# EAGLE design dedo_rev_1_0 (EAGLE 9.2.2)
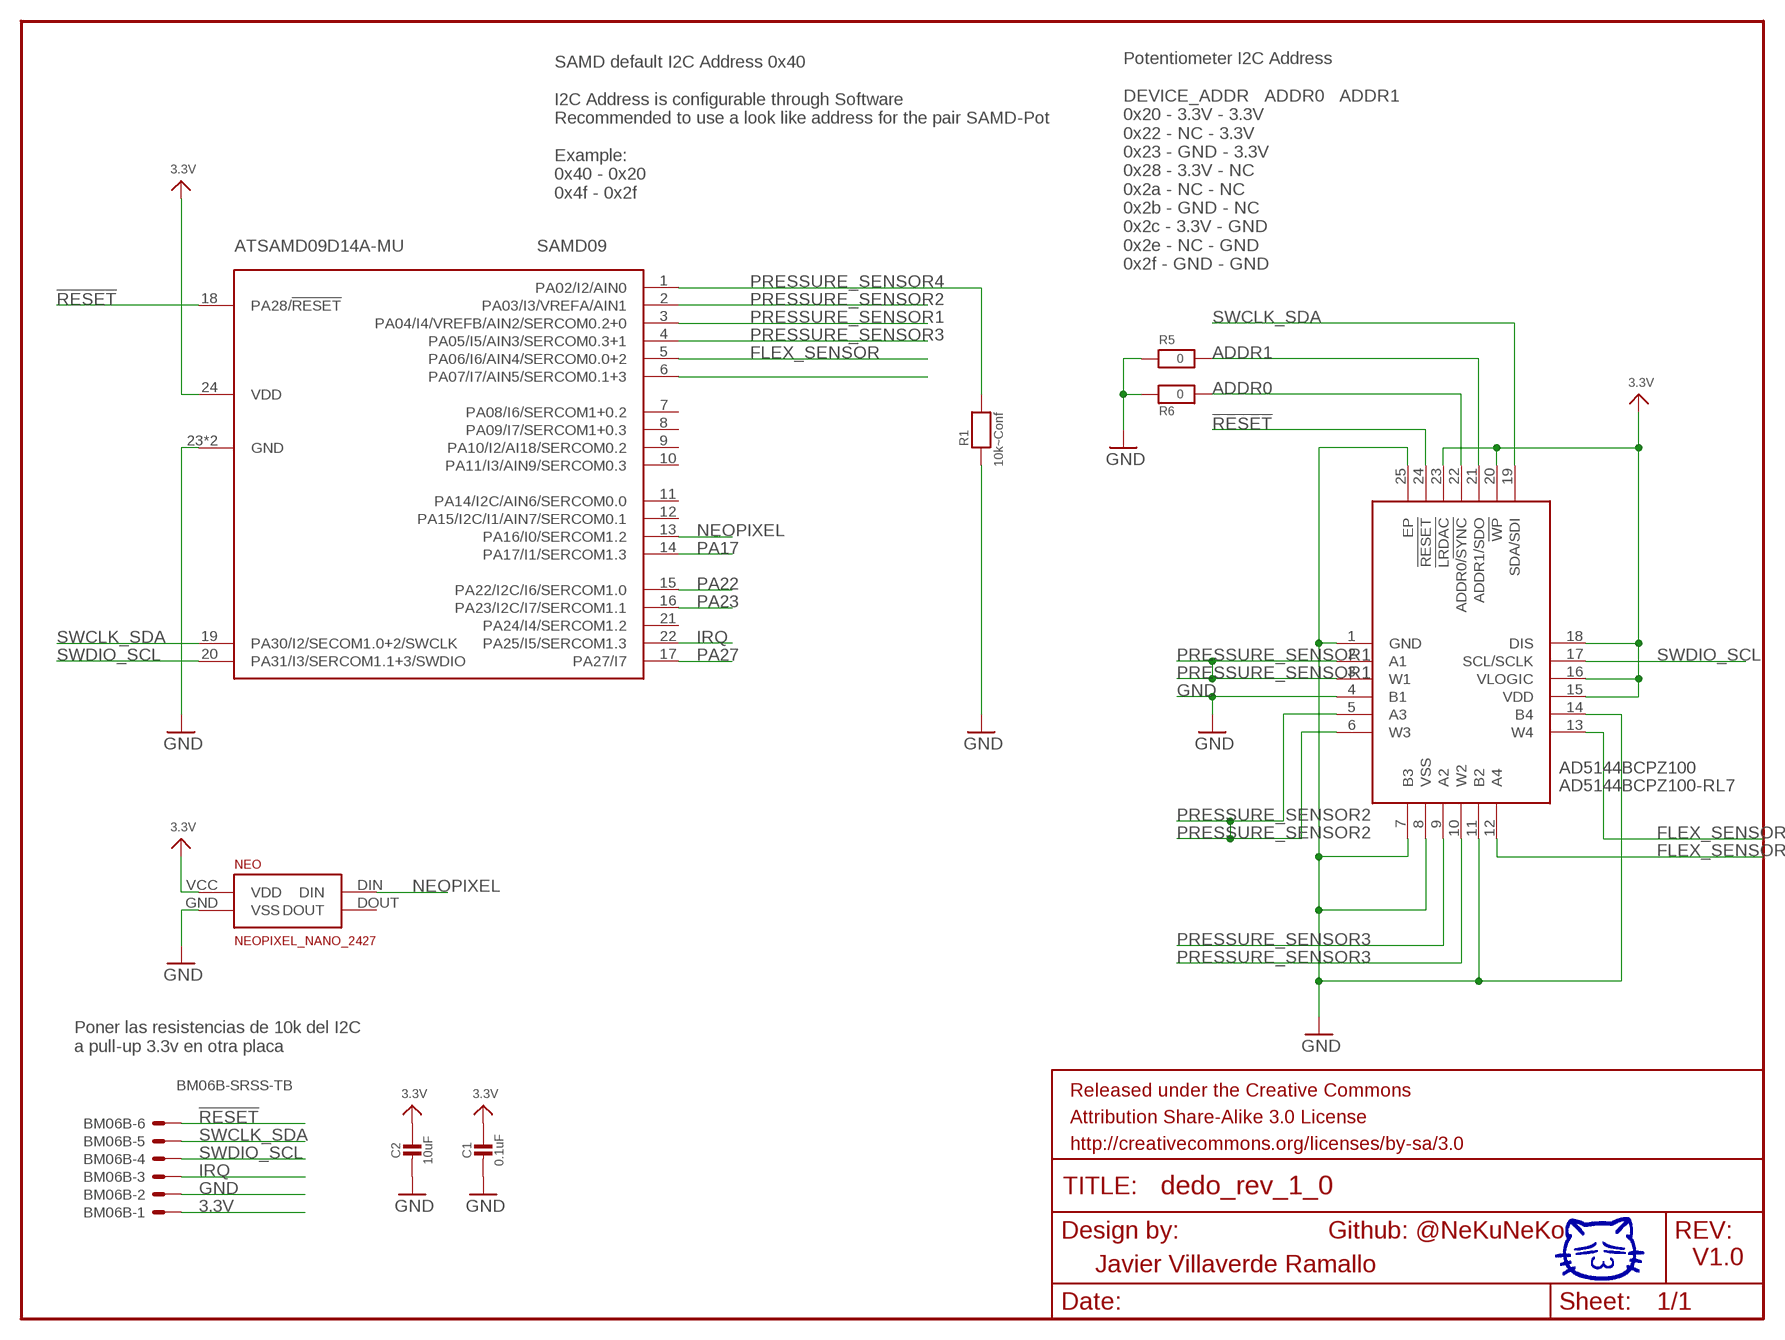
[diagram p0: schematic, sheet 1]

## Parts
AD5144BCPZ100  AD5144BCPZ100-RL7  [QFN50P400X400X80-25N]
BM06B  BM06B-SRSS-TB  [BM06B-SRSS-TB]
C1  0.1uF  CAP_CERAMIC0402  [0402]
C2  10uF  CAP_CERAMIC0402  [0402]
FRAME1  FRAME-LETTER  [CREATIVE_COMMONS]
FRAME2  FRAME-LETTER  [CREATIVE_COMMONS]
NEO  NEOPIXEL_NANO_2427  [SK6805-2427]
R1  10k~Conf  RESISTOR_0402  [_0402]
R5  0  RESISTOR_0402  [_0402]
R6  0  RESISTOR_0402  [_0402]
SAMD09  ATSAMD09D14A-MU  [QFN24_4MM]

## Nets
3.3V: AD5144BCPZ100.15(VDD) AD5144BCPZ100.16(VLOGIC) AD5144BCPZ100.18(DIS) AD5144BCPZ100.20(!WP) AD5144BCPZ100.23(!LRDAC) BM06B.1 C1.1 C2.1 NEO.VCC(VDD) SAMD09.24(VDD)
!RESET: AD5144BCPZ100.24(!RESET) BM06B.6 SAMD09.18(PA28/!RESET)
ADDR0: AD5144BCPZ100.22(ADDR0/!SYNC) R6.2
ADDR1: AD5144BCPZ100.21(ADDR1/SDO) R5.2
FLEX_SENSOR: AD5144BCPZ100.12(A4) AD5144BCPZ100.13(W4) SAMD09.5(PA06/I6/AIN4/SERCOM0.0+2)
GND: AD5144BCPZ100.1(GND) AD5144BCPZ100.4(B1) AD5144BCPZ100.7(B3) AD5144BCPZ100.8(VSS) AD5144BCPZ100.11(B2) AD5144BCPZ100.14(B4) AD5144BCPZ100.25(EP) BM06B.2 C1.2 C2.2 NEO.GND(VSS) R1.2 R5.1 R6.1 SAMD09.23(GND) SAMD09.THERM(GND)
IRQ: BM06B.3 SAMD09.22(PA25/I5/SERCOM1.3)
N$1: SAMD09.6(PA07/I7/AIN5/SERCOM0.1+3)
NEOPIXEL: NEO.DIN SAMD09.13(PA16/I0/SERCOM1.2)
PA17: SAMD09.14(PA17/I1/SERCOM1.3)
PA22: SAMD09.15(PA22/I2C/I6/SERCOM1.0)
PA23: SAMD09.16(PA23/I2C/I7/SERCOM1.1)
PA27: SAMD09.17(PA27/I7)
PRESSURE_SENSOR1: AD5144BCPZ100.2(A1) AD5144BCPZ100.3(W1) SAMD09.3(PA04/I4/VREFB/AIN2/SERCOM0.2+0)
PRESSURE_SENSOR2: AD5144BCPZ100.5(A3) AD5144BCPZ100.6(W3) SAMD09.2(PA03/I3/VREFA/AIN1)
PRESSURE_SENSOR3: AD5144BCPZ100.9(A2) AD5144BCPZ100.10(W2) SAMD09.4(PA05/I5/AIN3/SERCOM0.3+1)
PRESSURE_SENSOR4: R1.1 SAMD09.1(PA02/I2/AIN0)
SWCLK_SDA: AD5144BCPZ100.19(SDA/SDI) BM06B.5 SAMD09.19(PA30/I2/SECOM1.0+2/SWCLK)
SWDIO_SCL: AD5144BCPZ100.17(SCL/SCLK) BM06B.4 SAMD09.20(PA31/I3/SERCOM1.1+3/SWDIO)
Unconnected: NEO.DOUT SAMD09.7(PA08/I6/SERCOM1+0.2) SAMD09.8(PA09/I7/SERCOM1+0.3) SAMD09.9(PA10/I2/AI18/SERCOM0.2) SAMD09.10(PA11/I3/AIN9/SERCOM0.3) SAMD09.11(PA14/I2C/AIN6/SERCOM0.0) SAMD09.12(PA15/I2C/I1/AIN7/SERCOM0.1) SAMD09.21(PA24/I4/SERCOM1.2)

## Notes on the sheet
- SAMD default I2C Address 0x40
  
  I2C Address is configurable through Software
  Recommended to use a look like address for the pair SAMD-Pot
  
  Example: 
  0x40 - 0x20
  0x4f - 0x2f
- Potentiometer I2C Address
  
  DEVICE_ADDR   ADDR0   ADDR1   
  0x20 - 3.3V - 3.3V 
  0x22 - NC - 3.3V
  0x23 - GND - 3.3V
  0x28 - 3.3V - NC
  0x2a - NC - NC
  0x2b - GND - NC 
  0x2c - 3.3V - GND
  0x2e - NC - GND
  0x2f - GND - GND
- Poner las resistencias de 10k del I2C 
  a pull-up 3.3v en otra placa
- Github: @NeKuNeKo
- V1.0
- Javier Villaverde Ramallo

## Library data of the parts
AD5144BCPZ100 = SamacSys_Parts:AD5144BCPZ100-RL7: ANALOG DEVICES - AD5144BCPZ100-RL7 - DIGITAL POT, 100KOHM, QUAD, LFCSP-24 Source: Datasheet <http://www.analog.com/media/en/technical-documentation/data-sheets/AD5124_5144_5144A.pdf>; DESCRIPTION: ANALOG DEVICES - AD5144BCPZ100-RL7 - DIGITAL POT, 100KOHM, QUAD, LFCSP-24; HEIGHT: 0.8mm; MANUFACTURER_NAME: Analog Devices; MANUFACTURER_PART_NUMBER: AD5144BCPZ100-RL7; MOUSER_PART_NUMBER: 584-AD5144BCPZ100-R7; MOUSER_PRICE-STOCK: https://www.mouser.com/Search/Refine.aspx?Keyword=584-AD5144BCPZ100-R7
BM06B = con-jst:?M06B-SRSS-TB: Disconnectable Crimp style connector, 1.0mm pitch 6 contacts
C1 C2 = microbuilder:CAP_CERAMIC: Ceramic Capacitors 0402 - 0402 Surface Mount Capacitors 16pF 50V 5% [Digikey: 445-4899-2-ND] 18pF 50V 5% [Digikey: 490-1281-2-ND] 22pF 50V 5% [Digikey: 490-1283-2-ND] 68pF 50V 5% [Digikey: 490-1289-2-ND] 0.1uF 10V 10% [Digikey: 490-1318-2-ND] 1.0uF 6.3V 10% [Digikey: 490-1320-2-ND] 0603 - 0603 Surface Mount Capacitors 16 pF 50V 5% [Digikey: 445-5051-2-ND] 22 pF 50V [Digikey: PCC220ACVTR-ND] 33 pF 50V 5% [Digikey: 490-1415-1-ND] 56pF 50V 5% [Digikey: 490-1421-1-ND] 220pF 50V 5% [Digikey: 445-1285-1-ND] 680 pF 50V 2200 pF 50V 5% C0G [Digikey: 445-1297-1-ND] 5600 pF 100V 5% X7R [Digikey: 478-3711-1-ND] 0.1 µF 25V 10% [Digikey: PCC2277TR-ND] 0.22 µF 16V 10% X7R [Digikey: 445-1318-1-ND] 1.0 µF 25V 10% [Digikey: 445-5146-2-ND] 0603 - RF Specific 3pF 250V +/-0.1pF RF [Digikey: 712-1347-1-ND] 18 pF 250V 5% [Digikey: 478-3505-1-ND or 712-1322-1-ND] 56 pF 250V 5% C0G RF [Digikey: 490-4867-1-ND] 68 pF 250V RF [Digikey: 490-4868-1-ND] 0805 - 0805 Surface Mount Capacitors 220 pF 250V 2% RF Ceramic Capacitor [Digikey: 712-1398-1-ND] 1000 pF 50V 2% NP0 Ceramic Capacitor [Digikey: 478-3760-1-ND] 0.1 µF 25V 10% Ceramic Capacitor [Digikey: PCC1828TR-ND] 1.0 µF 16V 10% Ceramic Capacitor[Digikey: 490-1691-2-ND] 10.0 µF 10V 10% Ceramic Capacitor[Digikey: 709-1228-1-ND] 10.0 uF 16V 10% Ceramic Capacitor [Digikey: 478-5165-2-ND] 47 uF 6.3V 20% Ceramic Capacitor [Digikey: 587-1779-1-ND or 399-5506-1-ND] 1206 - 1206 Surface Mount Capacitors 47uF 10V 20% Ceramic Capacitor [Digikey: 490-5528-1-ND or 399-5508-1-ND or 445-6010-1-ND] 100uF 6.3V -20%, +80% Y5V Ceramic Capacitor (Digikey: 490-4512-1-ND, Mouser: 81-GRM31CF50J107ZE1L)
FRAME1 FRAME2 = SparkFun-Aesthetics:FRAME-LETTER: Schematic Frame Standard 8.5x11 US Letter frame
NEO = NeoPixel Nano 2427:NEOPIXEL_NANO_2427
R1 R5 R6 = microbuilder:RESISTOR: Resistors 0402 - 0402 Surface Mount Package 22 Ohm 1% 1/16W [Digikey: 311-22.0LRTR-ND] 33 Ohm 5% 1/16W 1.0K 5% 1/16W 1.5K 5% 1/16W 2.0K 1% 1/16W 10.0K 1% 1/16W [Digikey: 311-10.0KLRTR-ND] 10.0K 5% 1/16W [Digikey: RMCF0402JT10K0TR-ND] 12.1K 1% 1/16W [Digikey: 311-22.0LRTR-ND] 100.0K 5% 1/16W 0603 - 0603 Surface Mount Package 0 Ohm 1/10 Watt 1% Resistor 15 Ohm 1/10 Watt 1% Resistor 33 Ohm 1/10 Watt 1% Resistor 49.9 Ohm 1/10 Watt 1% Resistor 100 Ohm 1/10 Watt 1% Resistor 150 Ohm 1/10 Watt 1% Resistor 240 Ohm 1/10 Watt 1% Resistor 390 Ohm 1/10 Watt 1% Resistor 560 Ohm 1/10 Watt 1% Resistor 680 Ohm 1/10 Watt 1% Resistor 750 Ohm 1/10 Watt 1% Resistor 1.0K Ohm 1/10 Watt 1% Resistor 1.5K Ohm 1/10 Watt 1% Resistor 2.0K Ohm 1/10 Watt 1% Resistor 2.2K Ohm 1/10 Watt 1% Resistor 3.3K Ohm 1/10 Watt 1% Resistor 4.7K Ohm 1/10 Watt 1% Resistor 10.0K Ohm 1/10 Watt 1% Resistor 12.0K Ohm 1/10 Watt 1% Resistor 12.1K Ohm 1/10 Watt 1% Resistor 20.0K Ohm 1/10 Watt 1% Resistor 33.0K Ohm 1/10 Watt 1% Resistor 100.0K Ohm 1/10 Watt 1% Resistor 0805 - 0805 Surface Mount Package 0 Ohm 1/8 Watt 1% Resistor 33 Ohm 1/8 Watt 1% Resistor 100 Ohm 1/8 Watt 1% Resistor 150 Ohm 1/8 Watt 1% Resistor 200 Ohm 1/8 Watt 1% Resistor 240 Ohm 1/8 Watt 1% Resistor 330 Ohm 1/8 Watt 1% Resistor 390 Ohm 1/8 Watt 1% Resistor 470 Ohm 1/8 Watt 1% Resistor 1.0K Ohm 1/8 Watt 1% Resistor 1.5K Ohm 1/8 Watt 1% Resistor 2.0K Ohm 1/8 Watt 1% Resistor 4.7K Ohm 1/8 Watt 1% Resistor 5.1K Ohm 1/8 Watt 1% Resistor 5.6K Ohm 1/8 Watt 1% Resistor 10.0K Ohm 1/8 Watt 1% Resistor 22.0K Ohm 1/8 Watt 1% Resistor 33.0K Ohm 1/8 Watt 1% Resistor 100K Ohm 1/8 Watt 1% Resistor 1206 - 1206 Surface Mount Package 2012 - 2010 Surface Mount Package 0.11 Ohm 1/2 Watt 1% Resistor - Digikey: RHM.11UCT-ND
SAMD09 = microbuilder:ATSAMD09D14A

## Board
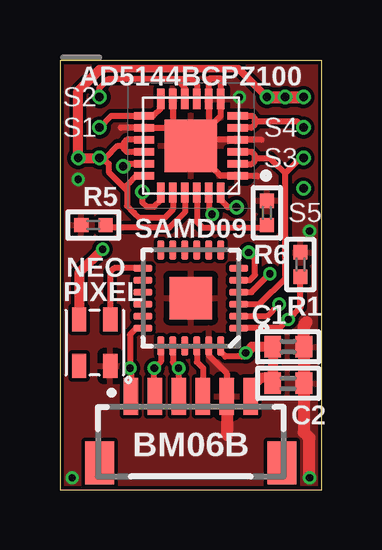
[diagram p1: board, top side]
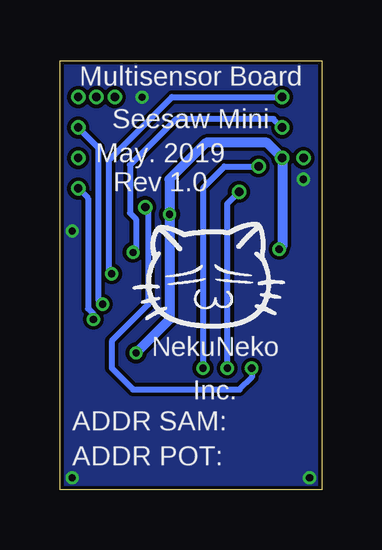
[diagram p2: board, bottom side, seen from below]

Size 10.92 x 17.91 mm. Coordinates in mm from the lower left corner, seen from the top.
Outline: 0,0 10.92,0 10.92,17.91 0,17.91 0,0
Copper layers (1*16): Top 0.035559375mm / dielectric 1.6mm / Bottom 0.035559375mm
Design rules "nekuneko": minimum track width 6mil, minimum drill 10mil, track to track 6mil, track to pad 6mil, pad to pad 6mil, via to via 6mil, smd to smd 6mil, copper to edge 6mil, drill to drill 6mil, minimum pad ring 5mil, minimum via ring 5mil, stop-mask expansion 2.5mil, vias tented up to drill 0mil, thermal gap 10mil

### Footprints (pad centres in the part's own frame; a part is rotated, then mirrored left to right if it is on the bottom)
QFN50P400X400X80-25N = smd 0.85 x 0.3: 1 -1.95,1.25; 2 -1.95,0.75; 3 -1.95,0.25; 4 -1.95,-0.25; 5 -1.95,-0.75; 6 -1.95,-1.25; 13 1.95,-1.25; 14 1.95,-0.75; 15 1.95,-0.25; 16 1.95,0.25; 17 1.95,0.75; 18 1.95,1.25 | smd 0.3 x 0.85: 7 -1.25,-1.95; 8 -0.75,-1.95; 9 -0.25,-1.95; 10 0.25,-1.95; 11 0.75,-1.95; 12 1.25,-1.95; 19 1.25,1.95; 20 0.75,1.95; 21 0.25,1.95; 22 -0.25,1.95; 23 -0.75,1.95; 24 -1.25,1.95 | smd 2.2 x 2.2: 25 0,0
BM06B-SRSS-TB = smd 0.6 x 1.55: 1 -2.5,-1.875; 2 -1.5,-1.875; 3 -0.5,-1.875; 4 0.5,-1.875; 5 1.5,-1.875; 6 2.5,-1.875 | smd 1.2 x 1.8: FIT@1 3.8,0.9; FIT@2 -3.8,0.9
0402 = smd 0.7 x 0.9: 1 -0.65,0; 2 0.65,0
SK6805-2427 = smd 1 x 0.6: DIN 0.375,1.85; DOUT 2.325,0.55; GND 2.325,1.85; VCC 0.375,0.55
_0402 = smd 0.6 x 0.6: 1 -0.508,0; 2 0.508,0
QFN24_4MM = smd 0.8 x 0.28: 1 -2,1.25; 2 -2,0.75; 3 -2,0.25; 4 -2,-0.25; 5 -2,-0.75; 6 -2,-1.25; 13 2,-1.25; 14 2,-0.75; 15 2,-0.25; 16 2,0.25; 17 2,0.75; 18 2,1.25 | smd 0.28 x 0.8: 7 -1.25,-2; 8 -0.75,-2; 9 -0.25,-2; 10 0.25,-2; 11 0.75,-2; 12 1.25,-2; 19 1.25,2; 20 0.75,2; 21 0.25,2; 22 -0.25,2; 23 -0.75,2; 24 -1.25,2 | smd 1.778 x 1.778: THERM 0,0

### Placement (x,y rotation side)
AD5144BCPZ100  5.46,14.35 180 top
BM06B  5.46,2.03 180 top
C1  9.53,5.97 0 top
C2  9.53,4.45 0 top
FRAME1  9.91,-63.5 0 top  (outside the outline)
FRAME2  12.95,-43.94 0 top  (outside the outline)
NEO  0.25,7.49 270 top
R1  10.03,9.4 90 top
R5  1.4,11.05 0 top
R6  8.64,11.56 270 top
SAMD09  5.46,8 180 top
U$1  [NEKO_DRAWN]  7.87,6.73 0 bottom

### Tracks (layer width: path | path; a pad name or v marks a point on that pad's centre or on a via)
3.3V  (via drill 0.3, 0.35)
  Top 0.254: v7.75,5.71 7.59,5.56 6.9,5.56 6.71,5.75 SAMD09.24 | AD5144BCPZ100.20 4.71,11.7 4.36,11.34 3.31,11.34 3.1,11.56 2.79,11.86 2.79,12.49 | AD5144BCPZ100.18 3.19,13.1 2.79,12.7 2.79,12.62 2.79,12.49 | AD5144BCPZ100.15 2.79,14.6 2.67,14.48 2.67,14.35 | 2.67,14.35 2.67,14.22 2.79,14.1 2.8,14.1 AD5144BCPZ100.16 | 2.67,14.35 2.41,14.35 1.91,13.84 v1.65,13.84 1.78,13.84 2.03,13.59 2.03,13.26 2.79,12.49 | AD5144BCPZ100.23 6.21,11.57 6.32,11.46 v6.35,11.49
  Top 0.305: 1.65,17.53 1.7,17.58 7.44,17.58 v8.64,16.38
  Top 0.406: BM06B.1 8,4.29 8.38,4.67 8.65,4.67 C2.1 8.88,4.95 C1.1 8,5.97 v7.75,5.71 | v1.78,10.03 0.8,9.06 NEO.VCC | 1.65,17.53 0.76,16.64 v0.76,13.84 v1.65,13.84
  Top 0.508: v8.64,16.38 v9.4,16.38 v10.16,16.38
  Bottom 0.406: v7.75,5.71 6.35,7.11 v6.35,11.49 6.35,12.95 4.83,14.48 2.29,14.48 v1.65,13.84 1.65,10.16 v1.78,10.03
!RESET  (via drill 0.3, 0.35)
  Top 0.254: v7.37,11.79 7,11.79 6.71,12.09 AD5144BCPZ100.24 | SAMD09.18 3.19,6.75 2.92,6.48 v2.92,5.08 2.96,5.04 BM06B.6
  Bottom 0.254: v7.37,11.79 7.24,11.67 7.24,7.73 8.76,6.21 8.76,5.08 7.87,4.19 3.43,4.19 2.92,4.7 v2.92,5.08
ADDR0
  Top 0.254: R6.2 8.75,10.93 5.96,10.93 5.71,11.18 AD5144BCPZ100.22
ADDR1
  Top 0.254: AD5144BCPZ100.21 5.21,11.57 4.57,10.93 2.02,10.93 R5.2
FLEX_SENSOR  (via drill 0.3, 0.35)
  Top 0.254: v1.65,15.11 2.14,15.6 AD5144BCPZ100.13 3.89,15.6 4.21,15.92 AD5144BCPZ100.12 | v7.87,9.91 8.14,9.64 8.14,8.97 7.92,8.75 SAMD09.5
  Bottom 0.254: v7.87,9.91 7.75,10.03 7.75,11.3 8,11.55 8,13.55 6.08,15.47 2.01,15.47 v1.65,15.11
GND  (via drill 0.3)
  Top 0.254: AD5144BCPZ100.25 5.91,14.52 5.99,14.6 8.43,14.6 | 5.52,14.29 6.71,13.11 6.98,13.11 6.98,13.1 AD5144BCPZ100.1 8.23,13.1 8.26,13.08 | 5.52,14.29 AD5144BCPZ100.25 | AD5144BCPZ100.25 6.71,15.6 6.71,15.87 AD5144BCPZ100.7 6.71,17.12 6.73,17.14 6.22,17.14 6.21,17.13 AD5144BCPZ100.8 6.21,14.97 5.52,14.29 | AD5144BCPZ100.11 4.71,15.1 | 4.71,15.1 AD5144BCPZ100.25 | 4.71,15.1 AD5144BCPZ100.14 2.55,15.1 2.54,15.11 | 4.71,15.1 5.52,14.29 | SAMD09.23 6.21,5.6 6.96,4.85 BM06B.2
  Top 0.508: BM06B.2 6.96,2.31 6.99,2.29 | v10.41,0.51 10.41,2.18 10.18,2.42 C2.2 C1.2 10.18,6.8 10.21,6.83 10.21,6.91 10.29,6.99
  other vias: 10.41,10.79 0.76,12.95 7.49,16.38 0.51,0.51
  pour Top (isolate 0.012): 10.92,0 10.92,17.91 0,17.91 0,0
  pour Bottom (isolate 0.012): 0,0 10.92,0 10.92,17.91 0,17.91
IRQ
  Top 0.254: BM06B.3 5.97,5.08 5.71,5.34 SAMD09.22
NEOPIXEL
  Top 0.254: SAMD09.13 2.27,9.25 2.1,9.09 NEO.DIN
PRESSURE_SENSOR1  (via drill 0.35)
  Top 0.254: 7.42,13.59 AD5144BCPZ100.2 7.42,13.59 | 7.42,13.59 8,13.59 8.13,13.72 8.13,13.84 | 8.13,13.84 8.13,13.97 8,14.1 AD5144BCPZ100.3 | SAMD09.3 8.33,7.75 9.4,8.82 9.4,13.21 | 9.4,13.21 8.91,13.69 8.76,13.84 8.13,13.84 | 9.4,13.21 10.03,13.84 v10.16,13.84
PRESSURE_SENSOR2  (via drill 0.3, 0.35)
  Top 0.254: 7.43,15.62 AD5144BCPZ100.6 8.02,15.6 8.13,15.49 8.13,15.37 | AD5144BCPZ100.5 7.99,15.1 8.13,15.24 8.13,15.37 | SAMD09.2 8.65,7.25 v9.14,7.75 | v10.16,15.11 9.91,15.37 8.13,15.37
  Bottom 0.254: v9.14,7.75 9.32,7.92 9.32,14.27 v10.16,15.11
PRESSURE_SENSOR3  (via drill 0.3, 0.35)
  Top 0.254: SAMD09.4 8,8.25 v8.76,9.02 | v1.65,16.38 1.65,16.76 2.03,17.14 4.84,17.14 | 4.84,17.14 5.21,16.77 AD5144BCPZ100.10 | 4.84,17.14 5.46,17.14 5.71,16.89 AD5144BCPZ100.9
  Bottom 0.254: v8.76,9.02 8.89,9.14 8.89,13.74 6.25,16.38 v1.65,16.38
PRESSURE_SENSOR4  (via drill 0.3 pad 0.3, 0.35)
  Top 0.254: SAMD09.1 9.16,6.75 v9.53,7.11 10.03,7.62 R1.1
  Bottom 0.254: v9.53,7.11 9.53,7.34 9.75,7.57 9.75,12.16 v10.16,12.57
SWCLK_SDA  (via drill 0.3, 0.35)
  Top 0.254: BM06B.5 3.94,3.93 v3.94,5.08 4.21,5.35 SAMD09.19 | v3.45,12.43 3.45,11.99 3.63,11.81 3.94,11.81 4.21,12.09 AD5144BCPZ100.19
  Bottom 0.254: v3.45,12.43 3.94,11.94 v3.94,5.08
SWDIO_SCL  (via drill 0.3, 0.35)
  Top 0.254: SAMD09.20 4.71,5.32 v4.95,5.08 4.96,5.07 BM06B.4 | v2.64,13.49 2.75,13.6 AD5144BCPZ100.17
  Bottom 0.254: v2.64,13.49 4.06,13.49 4.95,12.6 v4.95,5.08

### Text on the board
tPlace: S2 | S1 | S4 | S3 | S5
bPlace: Multisensor Board | Seesaw Mini | May. 2019 / Rev 1.0 | NekuNeko / Inc. | ADDR SAM: / ADDR POT:
tNames: PIXEL